# Altium schematic sheet 上电检测.SchDoc
size A4; DocumentNumber: 17; SheetNumber: 17; SheetTotal: 30
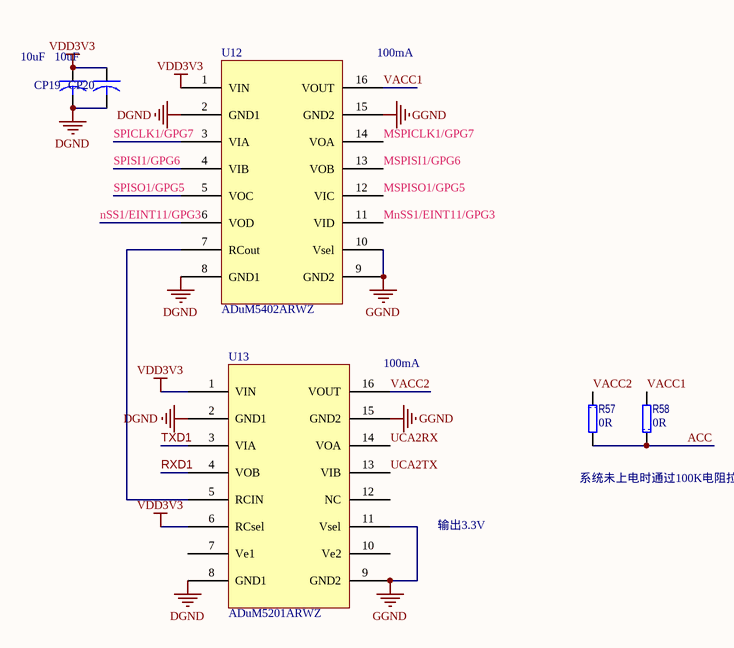
[diagram p0: 上电检测.SchDoc]

## Parts
CP19  value 10uF  [3216[1206]CB]  (hidden comment: TAJA106K016RNJ)
CP20  value 10uF  [3216[1206]CB]  (hidden comment: TAJA106K016RNJ)
R57  value 0R  [1608[0603]R]  (hidden comment: CRCW06030000ZSTA)
R58  value 0R  [1608[0603]R]  (hidden comment: CRCW06030000ZSTA)
U12  ADuM5402ARWZ  [SOIC16W_N]
U13  ADuM5201ARWZ  [SOIC16W_N]

## Nets
DGND: CP19.2 CP20.2 U12.2(GND1) U12.8(GND1) U13.2(GND1) U13.8(GND1)
GGND: U12.9(GND2) U12.10(Vsel) U12.15(GND2) U13.9(GND2) U13.11(Vsel) U13.15(GND2)
VDD3V3: CP19.1 CP20.1 U12.1(VIN) U13.1(VIN) U13.6(RCsel)
ACC: R57.2 R58.1
MnSS1/EINT11/GPG3: U12.11(VID)
MSPICLK1/GPG7: U12.14(VOA)
MSPISI1/GPG6: U12.13(VOB)
MSPISO1/GPG5: U12.12(VIC)
nSS1/EINT11/GPG3: U12.6(VOD)
RXD1: U13.4(VOB)
SPICLK1/GPG7: U12.3(VIA)
SPISI1/GPG6: U12.4(VIB)
SPISO1/GPG5: U12.5(VOC)
TXD1: U13.3(VIA)
UCA2RX: U13.14(VOA)
UCA2TX: U13.13(VIB)
VACC1: R58.2 U12.16(VOUT)
VACC2: R57.1 U13.16(VOUT)
NetU12_7: U12.7(RCout) U13.5(RCIN)

Not connected (* = marked no-connect by the designer): U13 7(Ve1) 10(Ve2) 12(NC)

## Notes on the sheet
- (near U12) 100mA
- (near U13) 100mA
- 系统未上电时通过100K电阻拉低
- 输出3.3V

## Library data of the parts
CP19 CP20 = CAPACITOR: 钽质电容器-固体SMD 16volts 10uF 10%; Manufacturer: AVX; ESR: 3 Ohms; 产品: Tantalum Solid Standard Grade - Other Various; 产品种类: SMD Tantalum Capacitors; 制造商库存号: A Case; 外壳代码 - in: 1206; 外壳代码 - mm: 3216; 封装 / 箱体: 1206 (3216 metric); 封装: Reel; 尺寸: 1.6 mm W x 3.2 mm L; 工作温度范围: - 55 C to + 125 C; 损耗因数 DF: 8; 标准包装数量: 2000; 漏泄电流: 1.6 uA; 电压额定值: 16 V; 端接类型: SMD/SMT; 系列: TAJ; 高度: 1.8 mm; Category: 钽质电容器-固体SMD; ComponentLink1Description: http://www.avx.com/docs/Catalogs/taj.pdf; ComponentLink1URL: http://www.avx.com/docs/Catalogs/taj.pdf; Description 1: 钽质电容器-固体SMD 16volts 10uF 10%; Manufacturer Part Number: TAJA106K016RNJ; Minimum Order Quantity: 1; Pricing 1: 1=0.600, 100=0.280, 200=0.250, 500=0.221, 1000=0.200, 2000=0.140, 5000=0.131, 10000=0.124, 25000=0.103 (USD); Reeling: True; RoHS - 贸泽: Y; RoHS: RoHS Compliant; Stock 1: 20335; Supplier 1: Mouser; Supplier Part Number 1: 581-TAJA106K016R; 制造商: AVX; 容差: 10 %; 电容: 10 uF
R57 R58 = RES: 厚膜电阻器 - SMD 1/10watt ZEROohm Jumper; Manufacturer: Vishay / Dale; 尺寸: 0.85 mm W x 1.55 mm L x 0.45 mm H; 工作温度范围: - 55 C to + 155 C; 封装 / 箱体: 0603 (1608 metric); 封装: Reel; 功率额定值: 100 mW; 产品: Thick Film Resistors Zero-Ohm; 电阻: 0 Ohms; 系列: CRCW; 温度系数: 200 PPM / C; 端接类型: SMD/SMT; 容差: 1 %; 电压额定值: 75 V; 外壳代码 - in: 0603; 外壳代码 - mm: 1608; 制造商: Vishay; 产品种类: 0603 Thick Film Chip Resistors; 标准包装数量: 5000; Supplier 1: Mouser; Supplier Part Number 1: 71-CRCW0603-0; Manufacturer Part Number: CRCW06030000ZSTA; RoHS: No; Category: 厚膜电阻器 - SMD; Stock 1: 44945; Pricing 1: 1=0.110, 10=0.064, 100=0.036, 1000=0.024, 5000=0.010, 10000=0.009, 25000=0.008, 50000=0.006 (USD); RoHS - 贸泽: N; Minimum Order Quantity: 1; Reeling: True; ComponentLink1URL: http://www.mouser.com/ds/2/427/dcrcw-72725.pdf; ComponentLink1Description: http://www.mouser.com/ds/2/427/dcrcw-72725.pdf; Description 1: 厚膜电阻器 - SMD 1/10watt ZEROohm Jumper
U12 = ADuM5402: 隔离器接口集成电路 Quad-CH w/ Intg DC/DC Converter; Manufacturer: Analog Devices; 封装 / 箱体: SOIC-16; 封装: Tube; 安装风格: SMD/SMT; 通道数量: 4; 线路数量（输入/输出）: 2 /; 功率耗散: 500 mW; 制造商: Analog Devices Inc.; 最大工作温度: + 105 C; 最小工作温度: - 40 C; 传播延迟时间: 60 ns; 标准包装数量: 47; 电源电压-最大: 5.5 V; 电源电压-最小: 3 V; Product Status: New at Mouser; Supplier 1: Mouser; Supplier Part Number 1: 584-ADUM5402ARWZ; Manufacturer Part Number: ADUM5402ARWZ; RoHS: RoHS Compliant; Description 1: 隔离器接口集成电路 Quad-CH w/ Intg DC/DC Converter; Category: 隔离器接口集成电路; Stock 1: 188; Pricing 1: 1=10.01, 5=9.38, 10=9.10, 25=8.42, 50=7.96, 100=7.74, 250=7.05, 500=6.60, 1000=6.07 (USD); RoHS - 贸泽: Y; Minimum Order Quantity: 1; Reeling: False; ComponentLink1URL: http://www.analog.com/static/imported-files/data_sheets/ADuM5401_5402_5403_5404.pdf; ComponentLink1Description: http://www.analog.com/static/imported-files/data_sheets/ADuM5401_5402_5403_5404.pdf
U13 = ADuM5201: 隔离器接口集成电路 Dual-CH w/ Intg DC/DC Converter; Manufacturer: Analog Devices; 封装 / 箱体: SOIC-16; 封装: Tube; 安装风格: SMD/SMT; 通道数量: 2; 线路数量（输入/输出）: 1 /; 制造商: Analog Devices Inc.; 最大工作温度: + 105 C; 最小工作温度: - 40 C; 传播延迟时间: 60 ns; 标准包装数量: 47; 电源电压-最大: 5.5 V; 电源电压-最小: 3 V; Product Status: New at Mouser; Supplier 1: Mouser; Supplier Part Number 1: 584-ADUM5201ARWZ; Manufacturer Part Number: ADUM5201ARWZ; RoHS: RoHS Compliant; Description 1: 隔离器接口集成电路 Dual-CH w/ Intg DC/DC Converter; Category: 隔离器接口集成电路; Stock 1: 213; Pricing 1: 1=9.20, 10=8.28, 25=7.54, 50=7.03, 100=6.80, 250=6.25, 500=5.70, 1000=4.96 (USD); RoHS - 贸泽: Y; Minimum Order Quantity: 1; Reeling: False; ComponentLink1URL: http://www.analog.com/static/imported-files/data_sheets/ADuM5200_5201_5202.pdf; ComponentLink1Description: http://www.analog.com/static/imported-files/data_sheets/ADuM5200_5201_5202.pdf